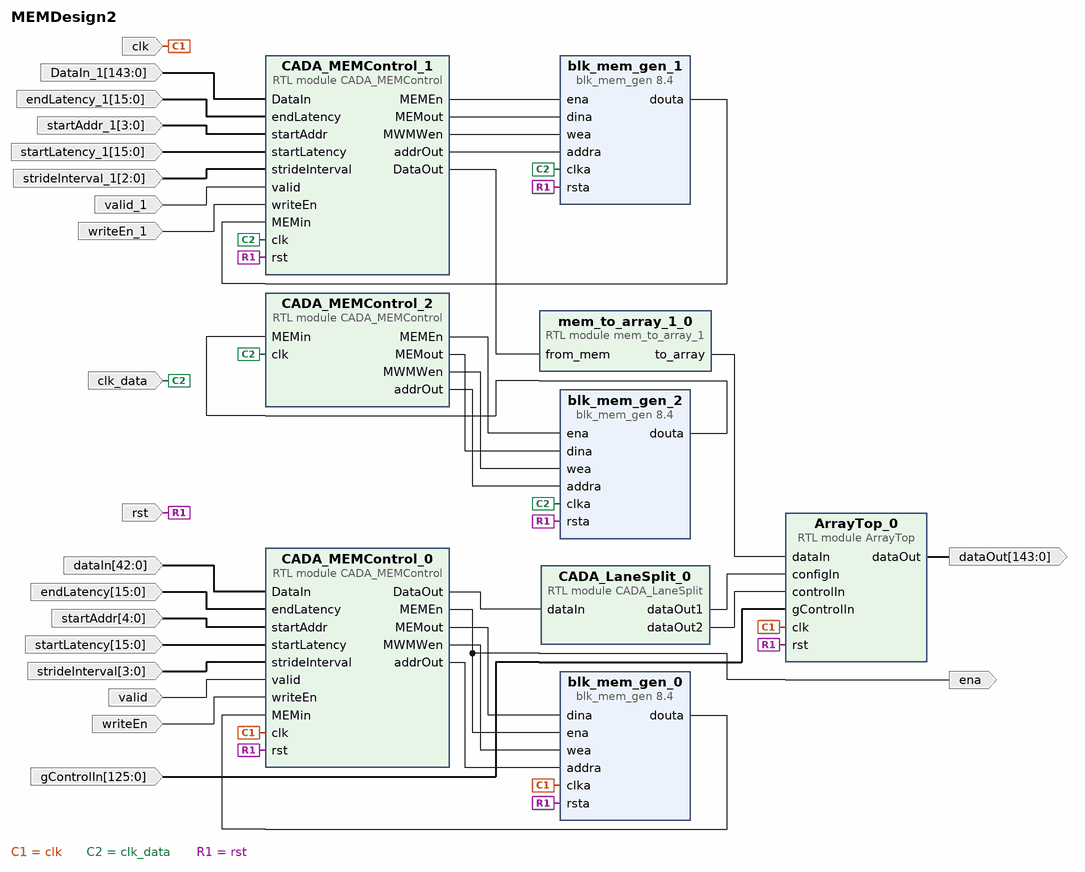
[diagram p0: block diagram of the top level]
# Vivado block design MEMDesign2, xc7z020clg400-2, Vivado 2023.2
create_bd_design MEMDesign2

create_bd_port -dir I -from 143 -to 0 DataIn_1
create_bd_port -dir I clk
create_bd_port -dir I clk_data
create_bd_port -dir I -from 42 -to 0 dataIn
create_bd_port -dir O -from 143 -to 0 dataOut
create_bd_port -dir O ena
create_bd_port -dir I -from 15 -to 0 endLatency
create_bd_port -dir I -from 15 -to 0 endLatency_1
create_bd_port -dir I -from 125 -to 0 gControlIn
create_bd_port -dir I rst
create_bd_port -dir I -from 4 -to 0 startAddr
create_bd_port -dir I -from 3 -to 0 startAddr_1
create_bd_port -dir I -from 15 -to 0 startLatency
create_bd_port -dir I -from 15 -to 0 startLatency_1
create_bd_port -dir I -from 3 -to 0 strideInterval
create_bd_port -dir I -from 2 -to 0 strideInterval_1
create_bd_port -dir I valid
create_bd_port -dir I valid_1
create_bd_port -dir I writeEn
create_bd_port -dir I writeEn_1

create_bd_cell -type module -reference ArrayTop ArrayTop_0
create_bd_cell -type module -reference CADA_LaneSplit CADA_LaneSplit_0
create_bd_cell -type module -reference CADA_MEMControl CADA_MEMControl_0
set_property -dict {CONFIG.Data_bitWidth 43} [get_bd_cells CADA_MEMControl_0]
create_bd_cell -type module -reference CADA_MEMControl CADA_MEMControl_1
set_property -dict {CONFIG.Data_bitWidth 144 CONFIG.addr_BW 4 CONFIG.stride_BW 3} [get_bd_cells CADA_MEMControl_1]
create_bd_cell -type ip -vlnv xilinx.com:ip:blk_mem_gen:8.4 blk_mem_gen_0
set_property -dict [list \
  CONFIG.Use_RSTA_Pin true \
  CONFIG.Write_Depth_A 32 \
  CONFIG.Write_Width_A 43 \
  CONFIG.use_bram_block Stand_Alone \
] [get_bd_cells blk_mem_gen_0]
create_bd_cell -type ip -vlnv xilinx.com:ip:blk_mem_gen:8.4 blk_mem_gen_1
set_property -dict [list \
  CONFIG.Coe_File ../../../MEMDesign/ip/MEMDesign_blk_mem_gen_0_1/layer1_im2col.coe \
  CONFIG.Load_Init_File true \
  CONFIG.Use_RSTA_Pin true \
  CONFIG.Write_Depth_A 16 \
  CONFIG.Write_Width_A 144 \
  CONFIG.use_bram_block Stand_Alone \
] [get_bd_cells blk_mem_gen_1]
create_bd_cell -type module -reference mem_to_array_1 mem_to_array_1_0
create_bd_cell -type ip -vlnv xilinx.com:ip:blk_mem_gen:8.4 blk_mem_gen_2
set_property -dict [list \
  CONFIG.Load_Init_File false \
  CONFIG.Read_Width_A 64 \
  CONFIG.Use_RSTA_Pin true \
  CONFIG.Write_Depth_A 20 \
  CONFIG.Write_Width_A 16 \
  CONFIG.use_bram_block Stand_Alone \
] [get_bd_cells blk_mem_gen_2]
create_bd_cell -type module -reference CADA_MEMControl CADA_MEMControl_2
set_property -dict {CONFIG.Data_bitWidth 144 CONFIG.addr_BW 4 CONFIG.stride_BW 3} [get_bd_cells CADA_MEMControl_2]

# ---- connections ----

connect_bd_net [get_bd_pins ArrayTop_0/dataOut] [get_bd_ports dataOut]
connect_bd_net [get_bd_pins CADA_LaneSplit_0/dataOut1] [get_bd_pins ArrayTop_0/configIn]
connect_bd_net [get_bd_pins CADA_LaneSplit_0/dataOut2] [get_bd_pins ArrayTop_0/controlIn]
connect_bd_net [get_bd_pins CADA_MEMControl_0/DataOut] [get_bd_pins CADA_LaneSplit_0/dataIn]
connect_bd_net [get_bd_pins CADA_MEMControl_0/MEMEn] [get_bd_pins blk_mem_gen_0/ena] [get_bd_ports ena]
connect_bd_net [get_bd_pins CADA_MEMControl_0/MEMout] [get_bd_pins blk_mem_gen_0/dina]
connect_bd_net [get_bd_pins CADA_MEMControl_0/MWMWen] [get_bd_pins blk_mem_gen_0/wea]
connect_bd_net [get_bd_pins CADA_MEMControl_0/addrOut] [get_bd_pins blk_mem_gen_0/addra]
connect_bd_net [get_bd_pins CADA_MEMControl_1/DataOut] [get_bd_pins mem_to_array_1_0/from_mem]
connect_bd_net [get_bd_pins CADA_MEMControl_1/MEMEn] [get_bd_pins blk_mem_gen_1/ena]
connect_bd_net [get_bd_pins CADA_MEMControl_1/MEMout] [get_bd_pins blk_mem_gen_1/dina]
connect_bd_net [get_bd_pins CADA_MEMControl_1/MWMWen] [get_bd_pins blk_mem_gen_1/wea]
connect_bd_net [get_bd_pins CADA_MEMControl_1/addrOut] [get_bd_pins blk_mem_gen_1/addra]
connect_bd_net [get_bd_pins CADA_MEMControl_2/MEMEn] [get_bd_pins blk_mem_gen_2/ena]
connect_bd_net [get_bd_pins CADA_MEMControl_2/MEMout] [get_bd_pins blk_mem_gen_2/dina]
connect_bd_net [get_bd_pins CADA_MEMControl_2/MWMWen] [get_bd_pins blk_mem_gen_2/wea]
connect_bd_net [get_bd_pins CADA_MEMControl_2/addrOut] [get_bd_pins blk_mem_gen_2/addra]
connect_bd_net -net DataIn_1_1 [get_bd_ports DataIn_1] [get_bd_pins CADA_MEMControl_1/DataIn]
connect_bd_net [get_bd_pins blk_mem_gen_0/douta] [get_bd_pins CADA_MEMControl_0/MEMin]
connect_bd_net [get_bd_pins blk_mem_gen_1/douta] [get_bd_pins CADA_MEMControl_1/MEMin]
connect_bd_net [get_bd_pins blk_mem_gen_2/douta] [get_bd_pins CADA_MEMControl_2/MEMin]
connect_bd_net [get_bd_ports clk] [get_bd_pins blk_mem_gen_0/clka] [get_bd_pins ArrayTop_0/clk] [get_bd_pins CADA_MEMControl_0/clk]
connect_bd_net [get_bd_ports clk_data] \
  [get_bd_pins blk_mem_gen_1/clka] [get_bd_pins blk_mem_gen_2/clka] [get_bd_pins CADA_MEMControl_1/clk] \
  [get_bd_pins CADA_MEMControl_2/clk]
connect_bd_net [get_bd_ports dataIn] [get_bd_pins CADA_MEMControl_0/DataIn]
connect_bd_net [get_bd_ports endLatency] [get_bd_pins CADA_MEMControl_0/endLatency]
connect_bd_net -net endLatency_1_1 [get_bd_ports endLatency_1] [get_bd_pins CADA_MEMControl_1/endLatency]
connect_bd_net [get_bd_ports gControlIn] [get_bd_pins ArrayTop_0/gControlIn]
connect_bd_net [get_bd_pins mem_to_array_1_0/to_array] [get_bd_pins ArrayTop_0/dataIn]
connect_bd_net [get_bd_ports rst] \
  [get_bd_pins blk_mem_gen_0/rsta] [get_bd_pins blk_mem_gen_1/rsta] [get_bd_pins blk_mem_gen_2/rsta] \
  [get_bd_pins ArrayTop_0/rst] [get_bd_pins CADA_MEMControl_0/rst] [get_bd_pins CADA_MEMControl_1/rst]
connect_bd_net [get_bd_ports startAddr] [get_bd_pins CADA_MEMControl_0/startAddr]
connect_bd_net -net startAddr_1_1 [get_bd_ports startAddr_1] [get_bd_pins CADA_MEMControl_1/startAddr]
connect_bd_net [get_bd_ports startLatency] [get_bd_pins CADA_MEMControl_0/startLatency]
connect_bd_net -net startLatency_1_1 [get_bd_ports startLatency_1] [get_bd_pins CADA_MEMControl_1/startLatency]
connect_bd_net [get_bd_ports strideInterval] [get_bd_pins CADA_MEMControl_0/strideInterval]
connect_bd_net -net strideInterval_1_1 [get_bd_ports strideInterval_1] [get_bd_pins CADA_MEMControl_1/strideInterval]
connect_bd_net [get_bd_ports valid] [get_bd_pins CADA_MEMControl_0/valid]
connect_bd_net -net valid_1_1 [get_bd_ports valid_1] [get_bd_pins CADA_MEMControl_1/valid]
connect_bd_net [get_bd_ports writeEn] [get_bd_pins CADA_MEMControl_0/writeEn]
connect_bd_net -net writeEn_1_1 [get_bd_ports writeEn_1] [get_bd_pins CADA_MEMControl_1/writeEn]

validate_bd_design
save_bd_design
